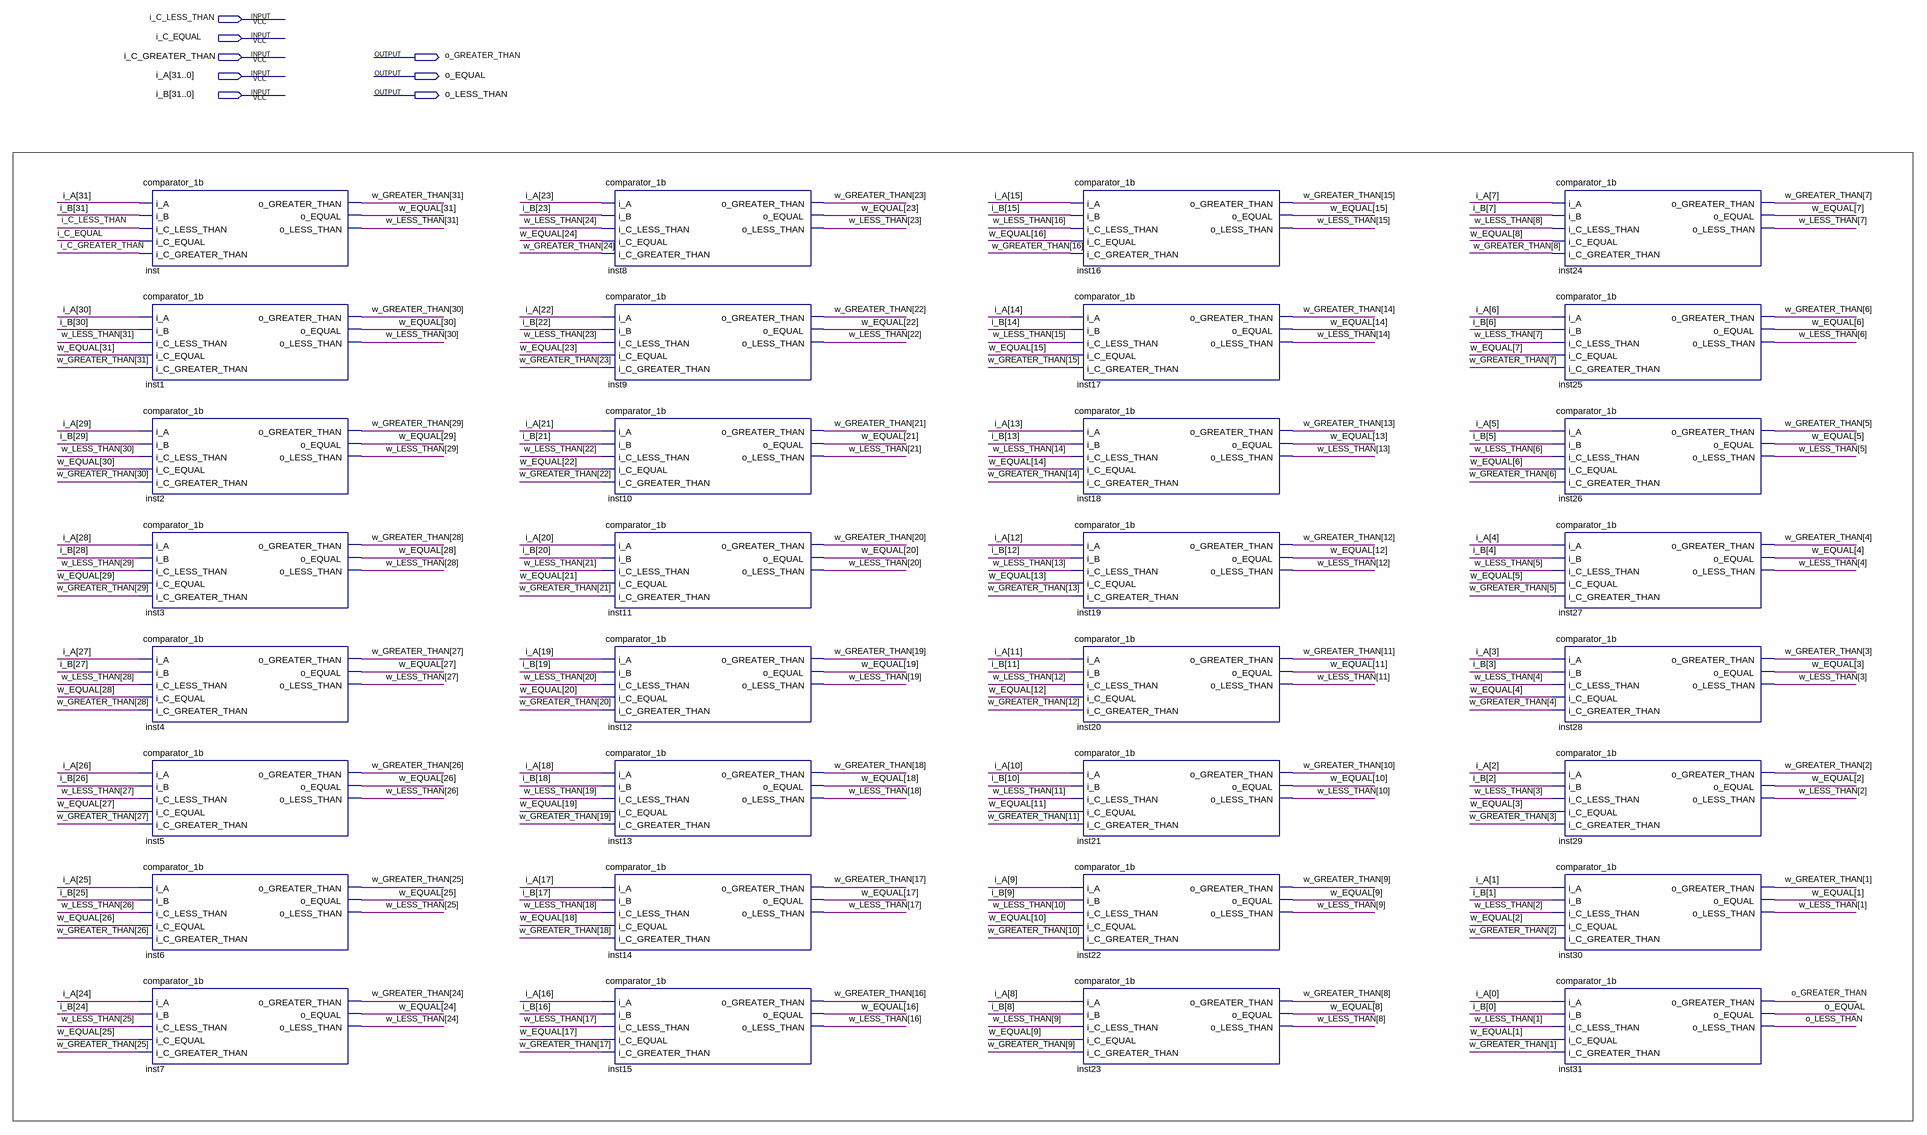
[diagram p0: schematic sheet]
// Quartus schematic comparator_32b.bdf as structural Verilog: 32 symbols, 8 pins
module comparator_32b (
  input  i_C_LESS_THAN,
  input  i_C_EQUAL,
  input  i_C_GREATER_THAN,
  input  [31:0] i_A,
  input  [31:0] i_B,
  output o_GREATER_THAN,
  output o_EQUAL,
  output o_LESS_THAN
);

  wire [31:1] w_EQUAL, w_GREATER_THAN, w_LESS_THAN;

  comparator_1b inst (
    .i_A(i_A[31]), .i_B(i_B[31]), .i_C_LESS_THAN(i_C_LESS_THAN), .i_C_EQUAL(i_C_EQUAL),
    .i_C_GREATER_THAN(i_C_GREATER_THAN), .o_GREATER_THAN(w_GREATER_THAN[31]), .o_EQUAL(w_EQUAL[31]),
    .o_LESS_THAN(w_LESS_THAN[31]));
  comparator_1b inst1 (
    .i_A(i_A[30]), .i_B(i_B[30]), .i_C_LESS_THAN(w_LESS_THAN[31]), .i_C_EQUAL(w_EQUAL[31]),
    .i_C_GREATER_THAN(w_GREATER_THAN[31]), .o_GREATER_THAN(w_GREATER_THAN[30]), .o_EQUAL(w_EQUAL[30]),
    .o_LESS_THAN(w_LESS_THAN[30]));
  comparator_1b inst2 (
    .i_A(i_A[29]), .i_B(i_B[29]), .i_C_LESS_THAN(w_LESS_THAN[30]), .i_C_EQUAL(w_EQUAL[30]),
    .i_C_GREATER_THAN(w_GREATER_THAN[30]), .o_GREATER_THAN(w_GREATER_THAN[29]), .o_EQUAL(w_EQUAL[29]),
    .o_LESS_THAN(w_LESS_THAN[29]));
  comparator_1b inst3 (
    .i_A(i_A[28]), .i_B(i_B[28]), .i_C_LESS_THAN(w_LESS_THAN[29]), .i_C_EQUAL(w_EQUAL[29]),
    .i_C_GREATER_THAN(w_GREATER_THAN[29]), .o_GREATER_THAN(w_GREATER_THAN[28]), .o_EQUAL(w_EQUAL[28]),
    .o_LESS_THAN(w_LESS_THAN[28]));
  comparator_1b inst4 (
    .i_A(i_A[27]), .i_B(i_B[27]), .i_C_LESS_THAN(w_LESS_THAN[28]), .i_C_EQUAL(w_EQUAL[28]),
    .i_C_GREATER_THAN(w_GREATER_THAN[28]), .o_GREATER_THAN(w_GREATER_THAN[27]), .o_EQUAL(w_EQUAL[27]),
    .o_LESS_THAN(w_LESS_THAN[27]));
  comparator_1b inst5 (
    .i_A(i_A[26]), .i_B(i_B[26]), .i_C_LESS_THAN(w_LESS_THAN[27]), .i_C_EQUAL(w_EQUAL[27]),
    .i_C_GREATER_THAN(w_GREATER_THAN[27]), .o_GREATER_THAN(w_GREATER_THAN[26]), .o_EQUAL(w_EQUAL[26]),
    .o_LESS_THAN(w_LESS_THAN[26]));
  comparator_1b inst6 (
    .i_A(i_A[25]), .i_B(i_B[25]), .i_C_LESS_THAN(w_LESS_THAN[26]), .i_C_EQUAL(w_EQUAL[26]),
    .i_C_GREATER_THAN(w_GREATER_THAN[26]), .o_GREATER_THAN(w_GREATER_THAN[25]), .o_EQUAL(w_EQUAL[25]),
    .o_LESS_THAN(w_LESS_THAN[25]));
  comparator_1b inst7 (
    .i_A(i_A[24]), .i_B(i_B[24]), .i_C_LESS_THAN(w_LESS_THAN[25]), .i_C_EQUAL(w_EQUAL[25]),
    .i_C_GREATER_THAN(w_GREATER_THAN[25]), .o_GREATER_THAN(w_GREATER_THAN[24]), .o_EQUAL(w_EQUAL[24]),
    .o_LESS_THAN(w_LESS_THAN[24]));
  comparator_1b inst8 (
    .i_A(i_A[23]), .i_B(i_B[23]), .i_C_LESS_THAN(w_LESS_THAN[24]), .i_C_EQUAL(w_EQUAL[24]),
    .i_C_GREATER_THAN(w_GREATER_THAN[24]), .o_GREATER_THAN(w_GREATER_THAN[23]), .o_EQUAL(w_EQUAL[23]),
    .o_LESS_THAN(w_LESS_THAN[23]));
  comparator_1b inst9 (
    .i_A(i_A[22]), .i_B(i_B[22]), .i_C_LESS_THAN(w_LESS_THAN[23]), .i_C_EQUAL(w_EQUAL[23]),
    .i_C_GREATER_THAN(w_GREATER_THAN[23]), .o_GREATER_THAN(w_GREATER_THAN[22]), .o_EQUAL(w_EQUAL[22]),
    .o_LESS_THAN(w_LESS_THAN[22]));
  comparator_1b inst10 (
    .i_A(i_A[21]), .i_B(i_B[21]), .i_C_LESS_THAN(w_LESS_THAN[22]), .i_C_EQUAL(w_EQUAL[22]),
    .i_C_GREATER_THAN(w_GREATER_THAN[22]), .o_GREATER_THAN(w_GREATER_THAN[21]), .o_EQUAL(w_EQUAL[21]),
    .o_LESS_THAN(w_LESS_THAN[21]));
  comparator_1b inst11 (
    .i_A(i_A[20]), .i_B(i_B[20]), .i_C_LESS_THAN(w_LESS_THAN[21]), .i_C_EQUAL(w_EQUAL[21]),
    .i_C_GREATER_THAN(w_GREATER_THAN[21]), .o_GREATER_THAN(w_GREATER_THAN[20]), .o_EQUAL(w_EQUAL[20]),
    .o_LESS_THAN(w_LESS_THAN[20]));
  comparator_1b inst12 (
    .i_A(i_A[19]), .i_B(i_B[19]), .i_C_LESS_THAN(w_LESS_THAN[20]), .i_C_EQUAL(w_EQUAL[20]),
    .i_C_GREATER_THAN(w_GREATER_THAN[20]), .o_GREATER_THAN(w_GREATER_THAN[19]), .o_EQUAL(w_EQUAL[19]),
    .o_LESS_THAN(w_LESS_THAN[19]));
  comparator_1b inst13 (
    .i_A(i_A[18]), .i_B(i_B[18]), .i_C_LESS_THAN(w_LESS_THAN[19]), .i_C_EQUAL(w_EQUAL[19]),
    .i_C_GREATER_THAN(w_GREATER_THAN[19]), .o_GREATER_THAN(w_GREATER_THAN[18]), .o_EQUAL(w_EQUAL[18]),
    .o_LESS_THAN(w_LESS_THAN[18]));
  comparator_1b inst14 (
    .i_A(i_A[17]), .i_B(i_B[17]), .i_C_LESS_THAN(w_LESS_THAN[18]), .i_C_EQUAL(w_EQUAL[18]),
    .i_C_GREATER_THAN(w_GREATER_THAN[18]), .o_GREATER_THAN(w_GREATER_THAN[17]), .o_EQUAL(w_EQUAL[17]),
    .o_LESS_THAN(w_LESS_THAN[17]));
  comparator_1b inst15 (
    .i_A(i_A[16]), .i_B(i_B[16]), .i_C_LESS_THAN(w_LESS_THAN[17]), .i_C_EQUAL(w_EQUAL[17]),
    .i_C_GREATER_THAN(w_GREATER_THAN[17]), .o_GREATER_THAN(w_GREATER_THAN[16]), .o_EQUAL(w_EQUAL[16]),
    .o_LESS_THAN(w_LESS_THAN[16]));
  comparator_1b inst16 (
    .i_A(i_A[15]), .i_B(i_B[15]), .i_C_LESS_THAN(w_LESS_THAN[16]), .i_C_EQUAL(w_EQUAL[16]),
    .i_C_GREATER_THAN(w_GREATER_THAN[16]), .o_GREATER_THAN(w_GREATER_THAN[15]), .o_EQUAL(w_EQUAL[15]),
    .o_LESS_THAN(w_LESS_THAN[15]));
  comparator_1b inst17 (
    .i_A(i_A[14]), .i_B(i_B[14]), .i_C_LESS_THAN(w_LESS_THAN[15]), .i_C_EQUAL(w_EQUAL[15]),
    .i_C_GREATER_THAN(w_GREATER_THAN[15]), .o_GREATER_THAN(w_GREATER_THAN[14]), .o_EQUAL(w_EQUAL[14]),
    .o_LESS_THAN(w_LESS_THAN[14]));
  comparator_1b inst18 (
    .i_A(i_A[13]), .i_B(i_B[13]), .i_C_LESS_THAN(w_LESS_THAN[14]), .i_C_EQUAL(w_EQUAL[14]),
    .i_C_GREATER_THAN(w_GREATER_THAN[14]), .o_GREATER_THAN(w_GREATER_THAN[13]), .o_EQUAL(w_EQUAL[13]),
    .o_LESS_THAN(w_LESS_THAN[13]));
  comparator_1b inst19 (
    .i_A(i_A[12]), .i_B(i_B[12]), .i_C_LESS_THAN(w_LESS_THAN[13]), .i_C_EQUAL(w_EQUAL[13]),
    .i_C_GREATER_THAN(w_GREATER_THAN[13]), .o_GREATER_THAN(w_GREATER_THAN[12]), .o_EQUAL(w_EQUAL[12]),
    .o_LESS_THAN(w_LESS_THAN[12]));
  comparator_1b inst20 (
    .i_A(i_A[11]), .i_B(i_B[11]), .i_C_LESS_THAN(w_LESS_THAN[12]), .i_C_EQUAL(w_EQUAL[12]),
    .i_C_GREATER_THAN(w_GREATER_THAN[12]), .o_GREATER_THAN(w_GREATER_THAN[11]), .o_EQUAL(w_EQUAL[11]),
    .o_LESS_THAN(w_LESS_THAN[11]));
  comparator_1b inst21 (
    .i_A(i_A[10]), .i_B(i_B[10]), .i_C_LESS_THAN(w_LESS_THAN[11]), .i_C_EQUAL(w_EQUAL[11]),
    .i_C_GREATER_THAN(w_GREATER_THAN[11]), .o_GREATER_THAN(w_GREATER_THAN[10]), .o_EQUAL(w_EQUAL[10]),
    .o_LESS_THAN(w_LESS_THAN[10]));
  comparator_1b inst22 (
    .i_A(i_A[9]), .i_B(i_B[9]), .i_C_LESS_THAN(w_LESS_THAN[10]), .i_C_EQUAL(w_EQUAL[10]),
    .i_C_GREATER_THAN(w_GREATER_THAN[10]), .o_GREATER_THAN(w_GREATER_THAN[9]), .o_EQUAL(w_EQUAL[9]),
    .o_LESS_THAN(w_LESS_THAN[9]));
  comparator_1b inst23 (
    .i_A(i_A[8]), .i_B(i_B[8]), .i_C_LESS_THAN(w_LESS_THAN[9]), .i_C_EQUAL(w_EQUAL[9]),
    .i_C_GREATER_THAN(w_GREATER_THAN[9]), .o_GREATER_THAN(w_GREATER_THAN[8]), .o_EQUAL(w_EQUAL[8]),
    .o_LESS_THAN(w_LESS_THAN[8]));
  comparator_1b inst24 (
    .i_A(i_A[7]), .i_B(i_B[7]), .i_C_LESS_THAN(w_LESS_THAN[8]), .i_C_EQUAL(w_EQUAL[8]),
    .i_C_GREATER_THAN(w_GREATER_THAN[8]), .o_GREATER_THAN(w_GREATER_THAN[7]), .o_EQUAL(w_EQUAL[7]),
    .o_LESS_THAN(w_LESS_THAN[7]));
  comparator_1b inst25 (
    .i_A(i_A[6]), .i_B(i_B[6]), .i_C_LESS_THAN(w_LESS_THAN[7]), .i_C_EQUAL(w_EQUAL[7]),
    .i_C_GREATER_THAN(w_GREATER_THAN[7]), .o_GREATER_THAN(w_GREATER_THAN[6]), .o_EQUAL(w_EQUAL[6]),
    .o_LESS_THAN(w_LESS_THAN[6]));
  comparator_1b inst26 (
    .i_A(i_A[5]), .i_B(i_B[5]), .i_C_LESS_THAN(w_LESS_THAN[6]), .i_C_EQUAL(w_EQUAL[6]),
    .i_C_GREATER_THAN(w_GREATER_THAN[6]), .o_GREATER_THAN(w_GREATER_THAN[5]), .o_EQUAL(w_EQUAL[5]),
    .o_LESS_THAN(w_LESS_THAN[5]));
  comparator_1b inst27 (
    .i_A(i_A[4]), .i_B(i_B[4]), .i_C_LESS_THAN(w_LESS_THAN[5]), .i_C_EQUAL(w_EQUAL[5]),
    .i_C_GREATER_THAN(w_GREATER_THAN[5]), .o_GREATER_THAN(w_GREATER_THAN[4]), .o_EQUAL(w_EQUAL[4]),
    .o_LESS_THAN(w_LESS_THAN[4]));
  comparator_1b inst28 (
    .i_A(i_A[3]), .i_B(i_B[3]), .i_C_LESS_THAN(w_LESS_THAN[4]), .i_C_EQUAL(w_EQUAL[4]),
    .i_C_GREATER_THAN(w_GREATER_THAN[4]), .o_GREATER_THAN(w_GREATER_THAN[3]), .o_EQUAL(w_EQUAL[3]),
    .o_LESS_THAN(w_LESS_THAN[3]));
  comparator_1b inst29 (
    .i_A(i_A[2]), .i_B(i_B[2]), .i_C_LESS_THAN(w_LESS_THAN[3]), .i_C_EQUAL(w_EQUAL[3]),
    .i_C_GREATER_THAN(w_GREATER_THAN[3]), .o_GREATER_THAN(w_GREATER_THAN[2]), .o_EQUAL(w_EQUAL[2]),
    .o_LESS_THAN(w_LESS_THAN[2]));
  comparator_1b inst30 (
    .i_A(i_A[1]), .i_B(i_B[1]), .i_C_LESS_THAN(w_LESS_THAN[2]), .i_C_EQUAL(w_EQUAL[2]),
    .i_C_GREATER_THAN(w_GREATER_THAN[2]), .o_GREATER_THAN(w_GREATER_THAN[1]), .o_EQUAL(w_EQUAL[1]),
    .o_LESS_THAN(w_LESS_THAN[1]));
  comparator_1b inst31 (
    .i_A(i_A[0]), .i_B(i_B[0]), .i_C_LESS_THAN(w_LESS_THAN[1]), .i_C_EQUAL(w_EQUAL[1]),
    .i_C_GREATER_THAN(w_GREATER_THAN[1]), .o_GREATER_THAN(o_GREATER_THAN), .o_EQUAL(o_EQUAL),
    .o_LESS_THAN(o_LESS_THAN));
endmodule
